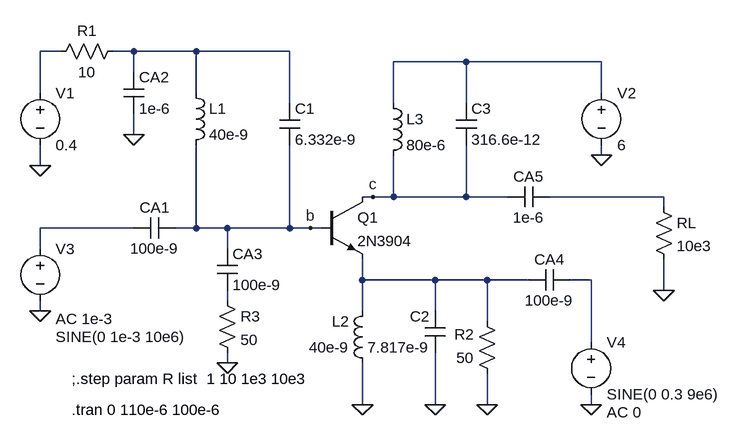
[diagram p0: schematic mezclador_bipolar.asc]
mezclador_bipolar.asc, the LTspice schematic file:
Version 4
SHEET 1 880 680
WIRE -544 -128 -576 -128
WIRE -432 -128 -464 -128
WIRE -336 -128 -432 -128
WIRE -192 -128 -336 -128
WIRE 80 -112 -32 -112
WIRE 288 -112 80 -112
WIRE -432 -96 -432 -128
WIRE -576 -64 -576 -128
WIRE -336 -64 -336 -128
WIRE 288 -64 288 -112
WIRE -192 -48 -192 -128
WIRE -32 -48 -32 -112
WIRE 80 -48 80 -112
WIRE -432 0 -432 -32
WIRE 288 32 288 16
WIRE -576 48 -576 16
WIRE -64 96 -80 96
WIRE -32 96 -32 32
WIRE -32 96 -64 96
WIRE 80 96 80 16
WIRE 80 96 -32 96
WIRE 144 96 80 96
WIRE 384 96 208 96
WIRE 384 112 384 96
WIRE -432 144 -576 144
WIRE -336 144 -336 16
WIRE -336 144 -368 144
WIRE -288 144 -336 144
WIRE -192 144 -192 16
WIRE -192 144 -288 144
WIRE -160 144 -192 144
WIRE -144 144 -160 144
WIRE -576 176 -576 144
WIRE -288 176 -288 144
WIRE -80 224 -80 192
WIRE 32 224 -80 224
WIRE 112 224 32 224
WIRE 176 224 112 224
WIRE 272 224 240 224
WIRE 384 240 384 192
WIRE -288 256 -288 240
WIRE -576 272 -576 256
WIRE -80 272 -80 224
WIRE 32 272 32 224
WIRE 112 288 112 224
WIRE 272 320 272 224
WIRE -288 352 -288 336
WIRE -80 416 -80 352
WIRE 32 416 32 336
WIRE 112 416 112 368
WIRE 272 416 272 400
FLAG -576 48 0
FLAG 288 32 0
FLAG 272 416 0
FLAG -576 272 0
FLAG -432 0 0
FLAG -160 144 b
FLAG -64 96 c
FLAG -288 352 0
FLAG 384 240 0
FLAG -80 416 0
FLAG 32 416 0
FLAG 112 416 0
SYMBOL npn -144 96 R0
SYMATTR InstName Q1
SYMATTR Value 2N3904
SYMBOL ind -352 -80 R0
SYMATTR InstName L1
SYMATTR Value 40e-9
SYMBOL ind -64 368 R180
WINDOW 0 36 80 Left 2
WINDOW 3 36 40 Left 2
SYMATTR InstName L2
SYMATTR Value 40e-9
SYMBOL cap -368 128 R90
WINDOW 0 0 32 VBottom 2
WINDOW 3 32 32 VTop 2
SYMATTR InstName CA1
SYMATTR Value 100e-9
SYMBOL cap 48 336 R180
WINDOW 0 24 56 Left 2
WINDOW 3 24 8 Left 2
SYMATTR InstName C2
SYMATTR Value 7.817e-9
SYMBOL voltage -576 -80 R0
WINDOW 123 0 0 Left 0
WINDOW 39 0 0 Left 0
SYMATTR InstName V1
SYMATTR Value 0.4
SYMBOL voltage 288 -80 R0
WINDOW 123 0 0 Left 0
WINDOW 39 0 0 Left 0
SYMATTR InstName V2
SYMATTR Value 6
SYMBOL voltage -576 160 R0
WINDOW 3 24 152 Left 2
WINDOW 123 24 124 Left 2
WINDOW 39 0 0 Left 0
SYMATTR Value SINE(0 1e-3 10e6)
SYMATTR Value2 AC 1e-3
SYMATTR InstName V3
SYMBOL res -448 -144 R90
WINDOW 0 0 56 VBottom 2
WINDOW 3 32 56 VTop 2
SYMATTR InstName R1
SYMATTR Value 10
SYMBOL cap -448 -96 R0
SYMATTR InstName CA2
SYMATTR Value 1e-6
SYMBOL cap -304 176 R0
SYMATTR InstName CA3
SYMATTR Value 100e-9
SYMBOL res -304 240 R0
SYMATTR InstName R3
SYMATTR Value 50
SYMBOL voltage 272 304 R0
WINDOW 123 24 124 Left 2
WINDOW 39 0 0 Left 0
SYMATTR Value2 AC 0
SYMATTR InstName V4
SYMATTR Value SINE(0 0.3 9e6)
SYMBOL cap -208 -48 R0
SYMATTR InstName C1
SYMATTR Value 6.332e-9
SYMBOL cap 208 80 R90
WINDOW 0 0 32 VBottom 2
WINDOW 3 32 32 VTop 2
SYMATTR InstName CA5
SYMATTR Value 1e-6
SYMBOL res 368 96 R0
SYMATTR InstName RL
SYMATTR Value 10e3
SYMBOL ind -48 -64 R0
SYMATTR InstName L3
SYMATTR Value 80e-6
SYMBOL cap 64 -48 R0
SYMATTR InstName C3
SYMATTR Value 316.6e-12
SYMBOL cap 240 208 R90
WINDOW 0 0 32 VBottom 2
WINDOW 3 32 32 VTop 2
SYMATTR InstName CA4
SYMATTR Value 100e-9
SYMBOL res 128 384 R180
WINDOW 0 36 76 Left 2
WINDOW 3 36 40 Left 2
SYMATTR InstName R2
SYMATTR Value 50
TEXT -528 424 Left 2 !.tran 0 110e-6 100e-6
TEXT -528 376 Left 2 !;.step param R list  1 10 1e3 10e3

The netlist it stands for:
* mezclador_bipolar.asc
Q1 c b N006 0 2N3904
L1 N002 b 40e-9
L2 0 N006 40e-9
CA1 b N005 100e-9
C2 0 N006 7.817e-9
V1 N001 0 0.4
V2 N003 0 6
V3 N005 0 SINE(0 1e-3 10e6) AC 1e-3
R1 N002 N001 10
CA2 N002 0 1e-6
CA3 b N008 100e-9
R3 N008 0 50
V4 N007 0 SINE(0 0.3 9e6) AC 0
C1 N002 b 6.332e-9
CA5 N004 c 1e-6
RL N004 0 10e3
L3 N003 c 80e-6
C3 N003 c 316.6e-12
CA4 N007 N006 100e-9
R2 0 N006 50
.model NPN NPN
.model PNP PNP
.lib standard.bjt
.tran 0 110e-6 100e-6
;.step param R list  1 10 1e3 10e3
.backanno
.end